# Altium schematic sheet 06_SAMA7G54-PMIC.SchDoc
size 420 x 297 mm; SheetNumber: 26; SheetTotal: 29
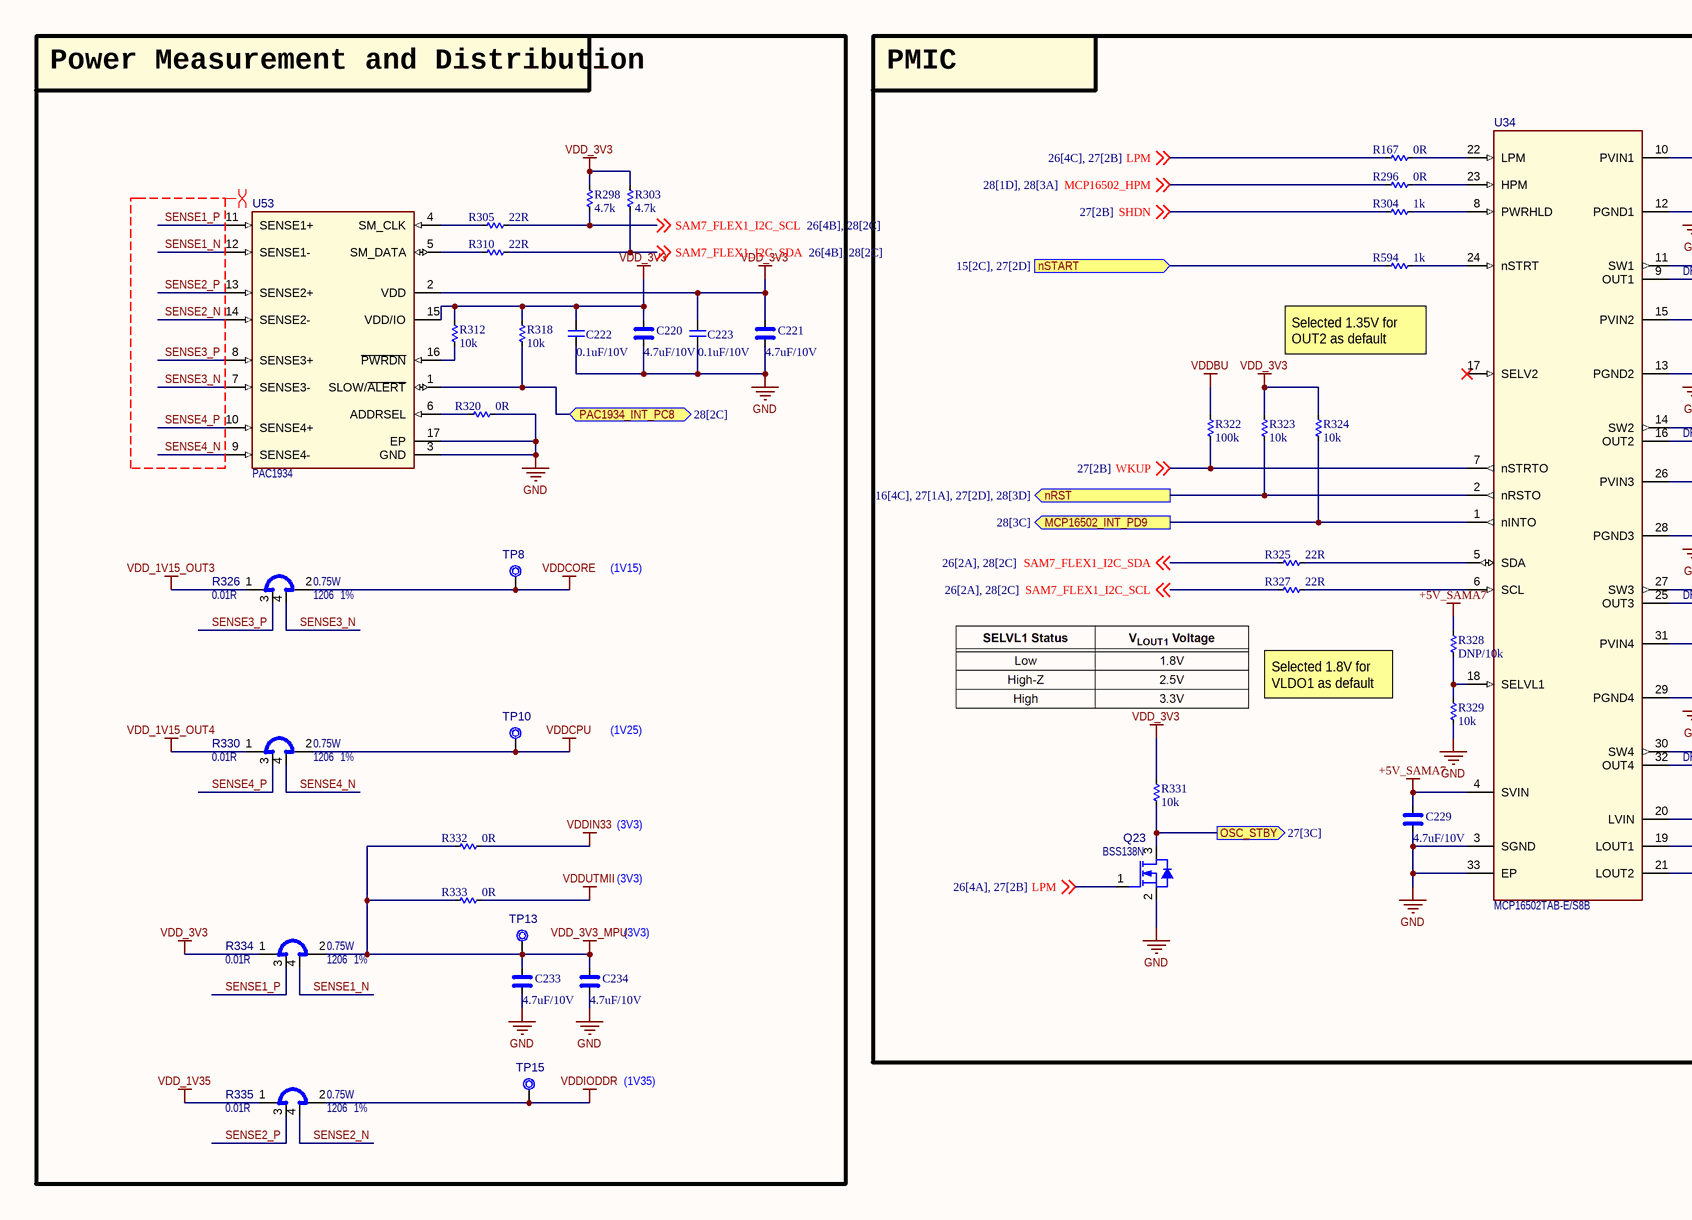
[diagram p0: 06_SAMA7G54-PMIC.SchDoc, left]
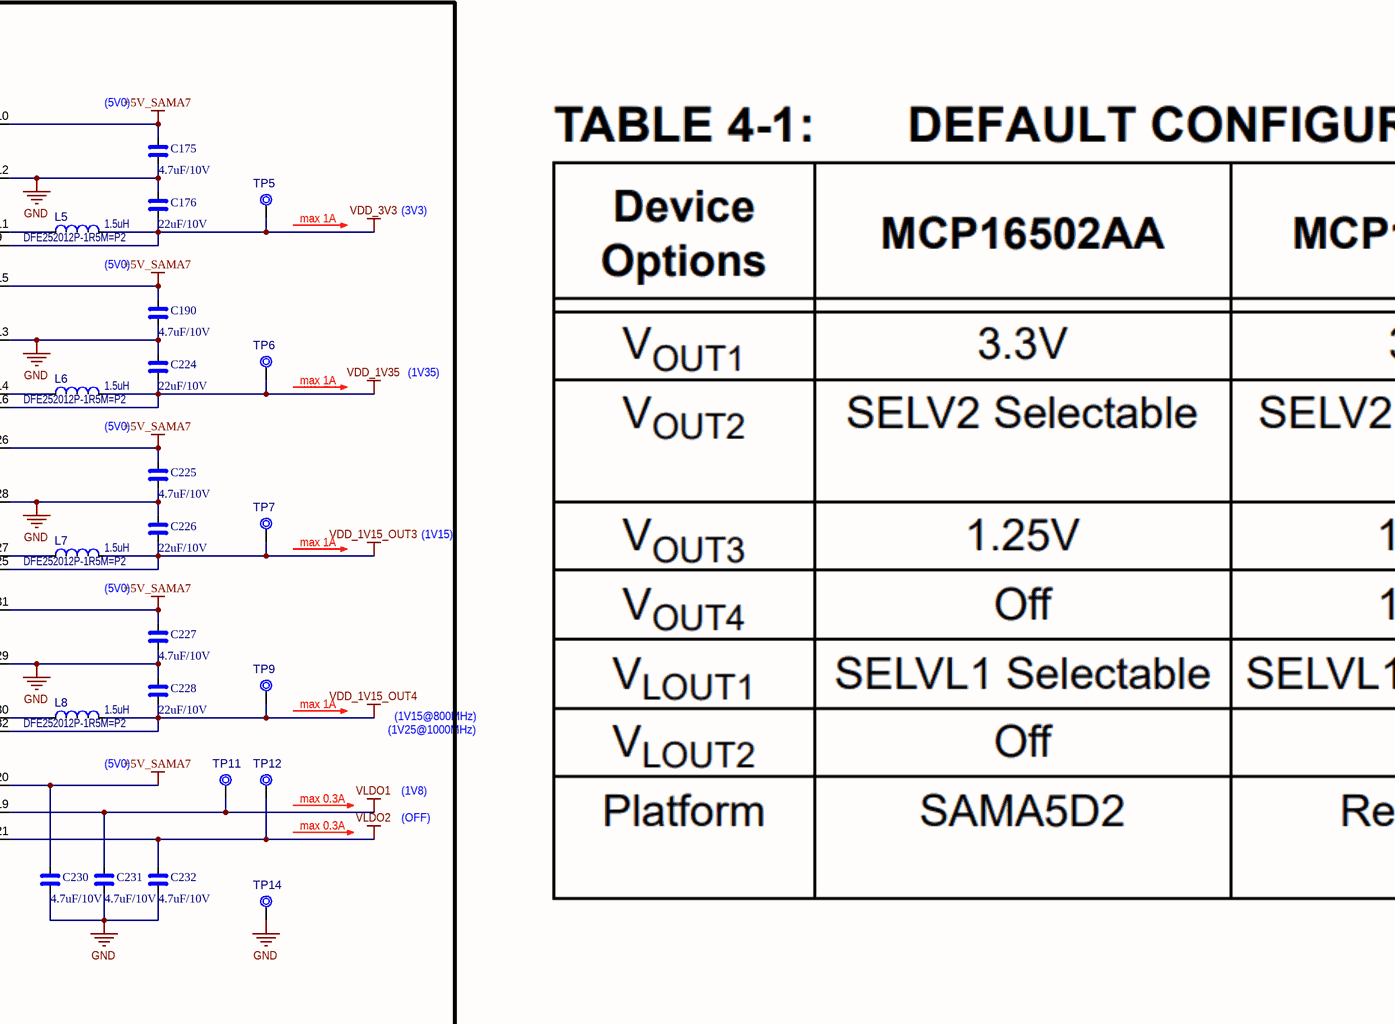
[diagram p1: 06_SAMA7G54-PMIC.SchDoc, middle]
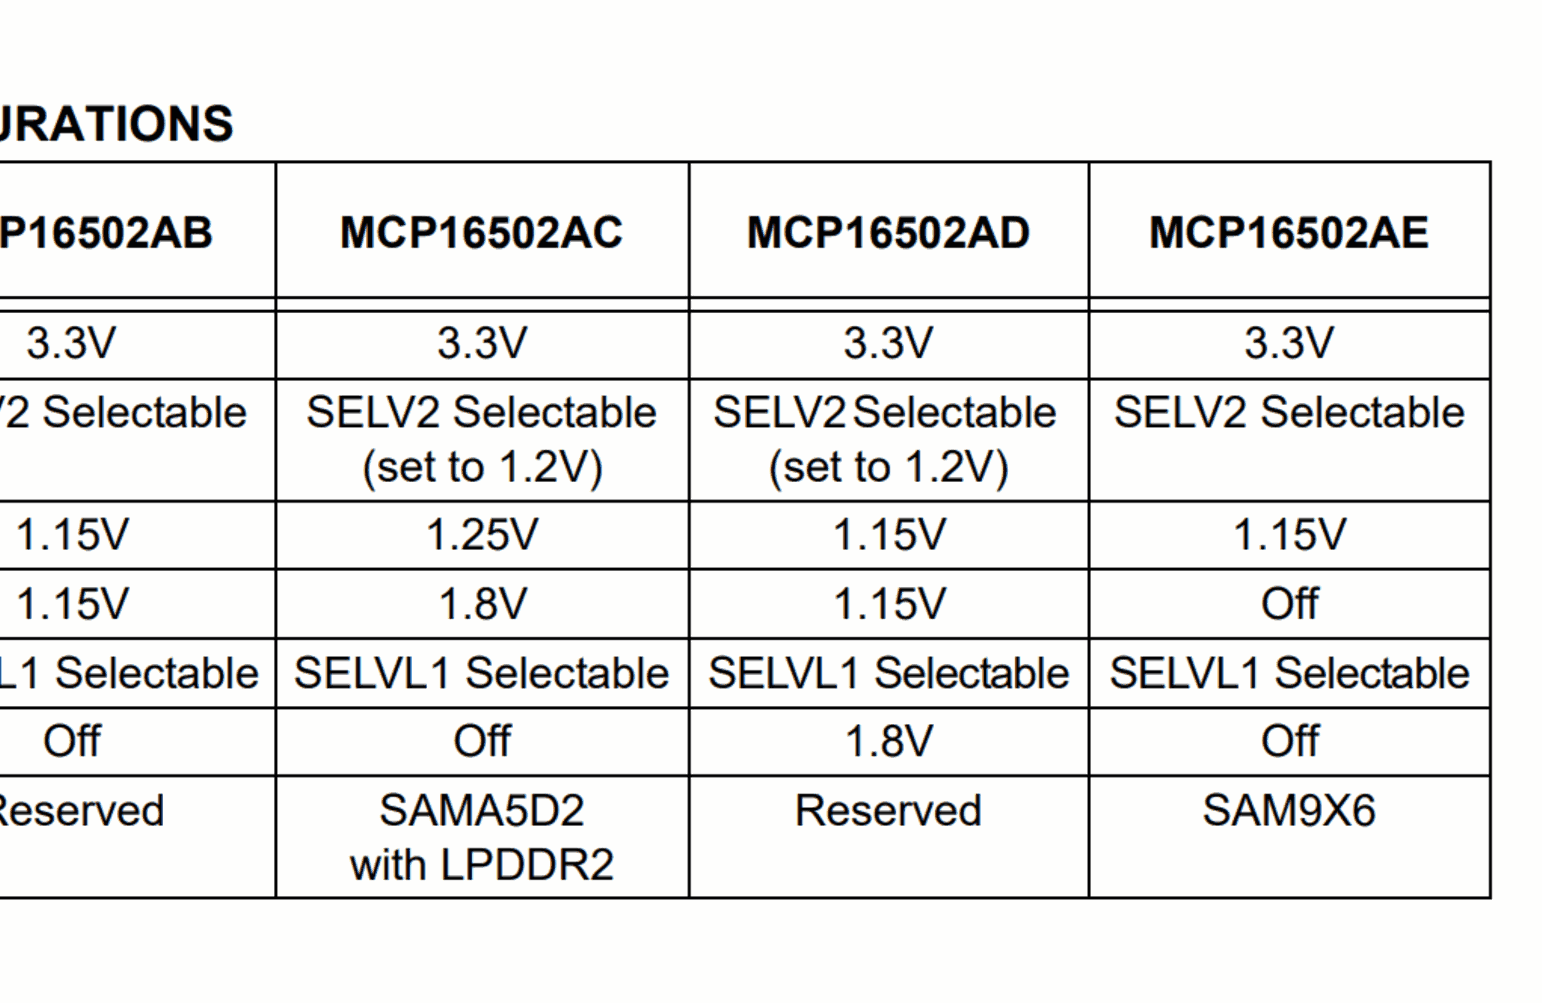
[diagram p2: 06_SAMA7G54-PMIC.SchDoc, right]

## Parts
C175  4.7uF/10V  [CAP_C_1005X50_L]
C176  22uF/10V  [CAP_C_1608X80]
C190  4.7uF/10V  [CAP_C_1005X50_L]
C220  4.7uF/10V  [CAP_C_1005X60]
C221  4.7uF/10V  [CAP_C_1005X60]
C222  0.1uF/10V  [CAP_C_1005X60]
C223  0.1uF/10V  [CAP_C_1005X60]
C224  22uF/10V  [CAP_C_1608X80]
C225  4.7uF/10V  [CAP_C_1005X50_L]
C226  22uF/10V  [CAP_C_1608X80]
C227  4.7uF/10V  [CAP_C_1005X50_L]
C228  22uF/10V  [CAP_C_1608X80]
C229  4.7uF/10V  [CAP_C_1005X50_L]
C230  4.7uF/10V  [CAP_C_1005X50_L]
C231  4.7uF/10V  [CAP_C_1005X50_L]
C232  4.7uF/10V  [CAP_C_1005X50_L]
C233  4.7uF/10V  [CAP_C_1005X60]
C234  4.7uF/10V  [CAP_C_1005X60]
L5  value 1.5uH  Manufacturer Part Number 1: DFE252012P-1R5M=P2  [IND_C_1008]  (hidden comment: Inductor)
L6  value 1.5uH  Manufacturer Part Number 1: DFE252012P-1R5M=P2  [IND_C_1008]  (hidden comment: Inductor)
L7  value 1.5uH  Manufacturer Part Number 1: DFE252012P-1R5M=P2  [IND_C_1008]  (hidden comment: Inductor)
L8  value 1.5uH  Manufacturer Part Number 1: DFE252012P-1R5M=P2  [IND_C_1008]  (hidden comment: Inductor)
Q23  value BSS138N  [SOT-23-3]  (hidden comment: Transistor MOS-N GSD)
R167  0R  [RES_C_1608X60]
R296  0R  [RES_C_1608X60]
R298  4.7k  [RES_C_1005X40]
R303  4.7k  [RES_C_1005X40]
R304  1k  [RES_C_1005X40]
R305  22R  [RES_C_1005X40]
R310  22R  [RES_C_1005X40]
R312  10k  [RES_C_1005X40]
R318  10k  [RES_C_1005X40]
R320  0R  [RES_C_1005X40]
R322  100k  [RES_C_1005X40]
R323  10k  [RES_C_1005X40]
R324  10k  [RES_C_1005X40]
R325  22R  [RES_C_0603X30]
R326  value 0.01R  Package: 1206  Tolerance: 1%  Power: 0.75W  [RES_C_1206_SHUNT]  (hidden comment: Shunt 4 Pin)
R327  22R  [RES_C_0603X30]
R328  DNP/10k  [RES_C_1005X40]
R329  10k  [RES_C_1005X40]
R330  value 0.01R  Package: 1206  Tolerance: 1%  Power: 0.75W  [RES_C_1206_SHUNT]  (hidden comment: Shunt 4 Pin)
R331  10k  [RES_C_1005X40]
R332  0R  [RES_C_1608X60]
R333  0R  [RES_C_1608X60]
R334  value 0.01R  Package: 1206  Tolerance: 1%  Power: 0.75W  [RES_C_1206_SHUNT]  (hidden comment: Shunt 4 Pin)
R335  value 0.01R  Package: 1206  Tolerance: 1%  Power: 0.75W  [RES_C_1206_SHUNT]  (hidden comment: Shunt 4 Pin)
R594  1k  [RES_C_1005X40]
TP5  Test Point No BOM  [Testpoint_80]  (value not drawn)  (no BOM)
TP6  Test Point No BOM  [Testpoint_80]  (value not drawn)  (no BOM)
TP7  Test Point No BOM  [Testpoint_80]  (value not drawn)  (no BOM)
TP8  Test Point No BOM  [Testpoint_80]  (value not drawn)  (no BOM)
TP9  Test Point No BOM  [Testpoint_80]  (value not drawn)  (no BOM)
TP10  Test Point No BOM  [Testpoint_80]  (value not drawn)  (no BOM)
TP11  Test Point No BOM  [Testpoint_80]  (value not drawn)  (no BOM)
TP12  Test Point No BOM  [Testpoint_80]  (value not drawn)  (no BOM)
TP13  Test Point No BOM  [Testpoint_80]  (value not drawn)  (no BOM)
TP14  Test Point No BOM  [Testpoint_80]  (value not drawn)  (no BOM)
TP15  Test Point No BOM  [Testpoint_80]  (value not drawn)  (no BOM)
U34  MCP16502TAB-E/S8B  [QFN-32_5X5_EP3.7X3.7]
U53  value PAC1934  [UQFN-16_4X4_EP2.6X2.6]  (hidden comment: PAC1934 UQFN-16)

## Blocks framed on the sheet
Power Measurement and Distribution: C220-C223 C233 C234 R298 R303 R305 R310 R312 R318 R320 R326 R330 R332-R335 TP8 TP10 TP13 TP15 U53
PMIC: C175 C176 C190 C224-C232 L5-L8 Q23 R167 R296 R304 R322-R325 R327-R329 R331 R594 TP5-TP7 TP9 TP11 TP12 TP14 U34

## Ports
MCP16502_INT_PD9 (out, see 28[3C]), nRST (out, see 16[4C], 27[1A], 27[2D], 28[3D]), nSTART (in, see 15[2C], 27[2D]), OSC_STBY (out, see 27[3C]), PAC1934_INT_PC8 (bidir, see 28[2C])

## Nets
+5V_SAMA7: C175.1 C190.1 C225.1 C227.1 C229.1 C230.1 R328.2 U34.4(SVIN) U34.10(PVIN1) U34.15(PVIN2) U34.20(LVIN) U34.26(PVIN3) U34.31(PVIN4)
GND: C175.2 C176.1 C190.2 C220.2 C221.2 C222.2 C223.2 C224.1 C225.2 C226.1 C227.2 C228.1 C229.2 C230.2 C231.2 C232.2 C233.2 C234.2 Q23.2(S) R320.2 R329.1 TP14.1 U34.3(SGND) U34.12(PGND1) U34.13(PGND2) U34.28(PGND3) U34.29(PGND4) U34.33(EP) U53.3(GND) U53.17(EP)
VDD_1V15_OUT3: C226.2 L7.2(F) R326.1 TP7.1 U34.25(OUT3)
VDD_1V15_OUT4: C228.2 L8.2(F) R330.1 TP9.1 U34.32(OUT4)
VDD_1V35: C224.2 L6.2(F) R335.1 TP6.1 U34.16(OUT2)
VDD_3V3: C176.2 C220.1 C221.1 C222.1 C223.1 L5.2(F) R298.1 R303.1 R312.1 R318.1 R323.2 R324.2 R331.2 R334.1 TP5.1 U34.9(OUT1) U53.2(VDD) U53.15(VDD/IO)
VDD_3V3_MPU: C233.1 C234.1 R332.2 R333.2 R334.2 TP13.1
VDDBU: R322.2
VDDCORE: R326.2 TP8.1
VDDCPU: R330.2 TP10.1
VDDIN33: R332.1
VDDIODDR: R335.2 TP15.1
VDDUTMII: R333.1
VLDO1: C231.1 TP11.1 U34.19(LOUT1)
VLDO2: C232.1 TP12.1 U34.21(LOUT2)
LPM: Q23.1(G) R167.2 ; off-sheet LPM
MCP16502_HPM: R296.2 ; off-sheet MCP16502_HPM
MCP16502_INT_PD9: R324.1 U34.1(nINTO) ; port MCP16502_INT_PD9
nRST: R323.1 U34.2(nRSTO) ; port nRST
nSTART: R594.1 ; port nSTART
OSC_STBY: Q23.3(D) R331.1 ; port OSC_STBY
PAC1934_INT_PC8: R318.2 U53.1(SLOW/~{ALERT}) ; port PAC1934_INT_PC8
SAM7_FLEX1_I2C_SCL: R298.2 R305.1 R327.2 ; off-sheet SAM7_FLEX1_I2C_SCL
SAM7_FLEX1_I2C_SDA: R303.2 R310.1 R325.2 ; off-sheet SAM7_FLEX1_I2C_SDA
SENSE1_N: R334.4 U53.12(SENSE1-)
SENSE1_P: R334.3 U53.11(SENSE1+)
SENSE2_N: R335.4 U53.14(SENSE2-)
SENSE2_P: R335.3 U53.13(SENSE2+)
SENSE3_N: R326.4 U53.7(SENSE3-)
SENSE3_P: R326.3 U53.8(SENSE3+)
SENSE4_N: R330.4 U53.9(SENSE4-)
SENSE4_P: R330.3 U53.10(SENSE4+)
SHDN: R304.1 ; off-sheet SHDN
WKUP: R322.1 U34.7(nSTRTO) ; off-sheet WKUP
NetL5_1: L5.1(S) U34.11(SW1)
NetL6_1: L6.1(S) U34.14(SW2)
NetL7_1: L7.1(S) U34.27(SW3)
NetL8_1: L8.1(S) U34.30(SW4)
NetR167_1: R167.1 U34.22(LPM)
NetR296_1: R296.1 U34.23(HPM)
NetR304_2: R304.2 U34.8(PWRHLD)
NetR305_2: R305.2 U53.4(SM_CLK)
NetR310_2: R310.2 U53.5(SM_DATA)
NetR312_2: R312.2 U53.16(~{PWRDN})
NetR320_1: R320.1 U53.6(ADDRSEL)
NetR325_1: R325.1 U34.5(SDA)
NetR327_1: R327.1 U34.6(SCL)
NetR328_1: R328.1 R329.2 U34.18(SELVL1)
NetR594_2: R594.2 U34.24(nSTRT)

Not connected (* = marked no-connect by the designer): U34 17(SELV2)*

## Layout directives
differential pair; differential pair class DIFF: SENSE1_N, SENSE1_P, SENSE2_N, SENSE2_P, SENSE3_N, SENSE3_P, SENSE4_N, SENSE4_P

## Notes on the sheet
- (near C175) (5V0)
- (5V0)
- (near TP5) max 1A
- (3V3)
- (near R594) Selected 1.35V for OUT2 as default
- (near TP6) max 1A
- (1V35)
- (1V15)
- (near TP7) max 1A
- Selected 1.8V for VLDO1 as default
- (1V25)
- (near TP9) max 1A
- (1V25@1000MHz)
- (1V15@800MHz)
- (near L8) (5V0)
- (near TP12) max 0.3A
- (1V8)
- (OFF)
- (near C234) (3V3)
- Project:
- Sub-system:
- Design by:
- Sheet title:
- Sheet
- of
- Checked by:
- Approved by:
- Revision:
- Document No:
- Size:
- Date:
- A3

## Library data of the parts
C175 C176 C190 C220 C221 C224-C234 = _CAP_C_High_2: CAP CHIP High Value
C222 C223 = _CAP_C_2: CAP CHIP
L5-L8 = IND1335: Manufacturer 1: Murata Electronics North America; Description_: INDUCTOR 1.5uH 3.5A 20% SMD 1008; Dev Tools Status: Design; Owner: Razvan Cristescu; DCR: 0.06R; RMS Current: 3.5A; Test Frequency: 1MHz; Populated: YES; MCHP-ID: IND1335; Revision: A; Symbol: Inductor; Status: MCL Design; ComponentLink1URL: https://chn-vm-apps.microchip.com/mchprepo/parts/Datasheets/m_dfe252012p.pdf; ComponentLink1Description: SVN Datasheet; ComponentLink2URL: C:\ALTIUM_WORK\00001_MCHP-CDB\Datasheets\m_dfe252012p.pdf; ComponentLink2Description: Local Datasheet; ComponentLink3URL: C:\ALTIUM_WORK\00001_MCHP-CDB\Library\LibraryRefs\Inductor.SchLib; ComponentLink3Description: Open Symbol; ComponentLink4URL: C:\ALTIUM_WORK\00001_MCHP-CDB\Library\Footprints\IND_C_1008.PcbLib; ComponentLink4Description: Open Footprint; ComponentLink5Description: Open Footprint 2; ComponentLink6Description: Open Footprint 3; ComponentLink7Description: Open Footprint 4; Package: 1008; Type: Inductor; Category: Inductor; Supplier 1: Digi-Key; Supplier Part Number 1: 490-10648-6-ND; Quantity Override: 1
Q23 = TRA1223: Transistor MOS; Manufacturer 1: Infineon Technologies; Manufacturer Part Number 1: BSS138NH6327XTSA2; Description_: TRANS FET N-CH BSS138N 60V 230mA SOT23-3; Dev Tools Status: Production; Type: FET; Current: 230mA; Drain to Source Voltage: 60V; Gate to Source Voltage: 20V; Power: 0.36W; Owner: Dragos Danaila; Populated: YES; MCHP-ID: TRA1223; Revision: 1; Symbol: Transistor MOS-N GSD; Status: MCL Design; Package: SOT23-3; ComponentLink1URL: https://chn-vm-apps.microchip.com/mchprepo/parts/Datasheets/Infineon-BSS138N-DS-v02_86-en.pdf; ComponentLink1Description: SVN Datasheet; ComponentLink2URL: C:\ALTIUM_WORK\00001_MCHP-CDB\Datasheets\Infineon-BSS138N-DS-v02_86-en.pdf; ComponentLink2Description: Local Datasheet; ComponentLink3URL: C:\ALTIUM_WORK\00001_MCHP-CDB\Library\LibraryRefs\Transistor MOS-N GSD.SchLib; ComponentLink3Description: Open Symbol; ComponentLink4URL: C:\ALTIUM_WORK\00001_MCHP-CDB\Library\Footprints\SOT-23-3.PcbLib; ComponentLink4Description: Open Footprint; ComponentLink5Description: Open Footprint 2; ComponentLink6Description: Open Footprint 3; ComponentLink7Description: Open Footprint 4; Operating Temperature: -55C to +150C; Category: Transistor; Voltage: 60V; Supplier 1: Digi-Key; Supplier Part Number 1: BSS138NH6327XTSA2CT-ND; Quantity Override: 1
R167 R296 R298 R303-R305 R310 R312 R318 R320 R322-R325 R327-R329 R331-R333 R594 = _RES_B_2: RES
R326 R330 R334 R335 = RSMT1316: Shunt; Manufacturer 1: SUSUMU; Manufacturer Part Number 1: KRL1632E-M-R010-F-T5; Description_: RES SHUNT MF 0.01R 1% 0.75W SMD 1206; Dev Tools Status: Design; Temperature Coeffcient: 50ppm/C; Current: 8A; Owner: Ciprian Abramov; Populated: YES; MCHP-ID: RSMT1316; Revision: 1; Symbol: Shunt 4 Pin; Status: MCL Design; ComponentLink1URL: https://chn-vm-apps.microchip.com/mchprepo/parts/Datasheets/n_catalog_partition09_en.pdf; ComponentLink1Description: SVN Datasheet; ComponentLink2URL: C:\ALTIUM_WORK\00001_MCHP-CDB\Datasheets\n_catalog_partition09_en.pdf; ComponentLink2Description: Local Datasheet; ComponentLink3URL: C:\ALTIUM_WORK\00001_MCHP-CDB\Library\LibraryRefs\Shunt 4 Pin.SchLib; ComponentLink3Description: Open Symbol; ComponentLink4URL: C:\ALTIUM_WORK\00001_MCHP-CDB\Library\Footprints\RES_C_1206_SHUNT.PcbLib; ComponentLink4Description: Open Footprint; ComponentLink5Description: Open Footprint 2; ComponentLink6Description: Open Footprint 3; ComponentLink7Description: Open Footprint 4; Operating Temperature: -55C to +155C; Category: Resistor; Type: RES SMD; Composition: MF; Supplier 1: Digi-Key; Supplier Part Number 1: 408-1570-1-ND; Quantity Override: 1
TP5-TP15 = CON1759: Test Point; Value: TP PAD PCB 1mm; Description_: CON TP PAD PCB 1mm SMD; Dev Tools Status: Design; Owner: Cristian Papuc; Populated: YES; MCHP-ID: CON1759; Revision: A; Symbol: Test Point No BOM; Status: MCL Design; ComponentLink1Description: SVN Datasheet; ComponentLink2Description: Local Datasheet; ComponentLink3URL: C:\ALTIUM_WORK\00001_MCHP-CDB\Library\LibraryRefs\Test Point No BOM.SchLib; ComponentLink3Description: Open Symbol; ComponentLink4URL: C:\ALTIUM_WORK\00001_MCHP-CDB\Library\Footprints\TP_1mm_SMD.PcbLib; ComponentLink4Description: Open Footprint; ComponentLink5Description: Open Footprint 2; ComponentLink6Description: Open Footprint 3; ComponentLink7Description: Open Footprint 4; Type: Test Point; Category: Connector; Quantity Override: 1
U34 = MIC8878: Manufacturer 1: Microchip Technology; Populated: YES; Description_: MCHP ANALOG PMIC SWITCHER Buck ADJ MCP16502TAB-E/S8B QFN-32 for SAMA7G5 MPU with LPDDR/DDR2/DDR3; Dev Tools Status: Design; Owner: Dragos Danaila; MCHP-ID: MIC8878; Value: MCP16502TAB-E/S8B; Symbol: MCP16502 QFN-32; Type: Switcher; Status: MCL Design; Revision: 1; Category: MCHP-Analog; ComponentLink1Description: SVN Datasheet; ComponentLink2Description: Local Datasheet; ComponentLink3URL: C:\ALTIUM_WORK\00001_MCHP-CDB\Library\LibraryRefs\MCP16502 QFN-32.SchLib; ComponentLink3Description: Open Symbol; ComponentLink4URL: C:\ALTIUM_WORK\00001_MCHP-CDB\Library\Footprints\QFN-32_5X5_EP3.7X3.7.PcbLib; ComponentLink4Description: Open Footprint; ComponentLink5Description: Open Footprint 2; ComponentLink6Description: Open Footprint 3; ComponentLink7Description: Open Footprint 4; Manufacturer Part Number 1: MCP16502TAB-E/S8B; Supplier 1: Digi-Key; Supplier Part Number 1: 150-MCP16502TAB-E/S8BCT-ND; Quantity Override: 1; ComponentLink2URL: C:\ALTIUM_WORK\00001_MCHP-CDB\Datasheets\MCP16502-High-Performance-PMIC-for-SAMA5DX-SAM9X6-MPUs-Data-Sheet-DS20006275B.pdf
U53 = MIC8883: Manufacturer 1: Microchip Technology; Manufacturer Part Number 1: PAC1934T-I/JQ; Description_: MCHP ANALOG POWER CURRENT SENSE MONITOR PAC1934T-I/JQ UQFN-16; Dev Tools Status: Design; Owner: Ciprian Abramov; Populated: YES; MCHP-ID: MIC8883; Symbol: PAC1934 UQFN-16; Type: Power/Current Sensor; Status: MCL Design; Revision: 1; Category: MCHP-Analog; ComponentLink1Description: SVN Datasheet; ComponentLink2Description: Local Datasheet; ComponentLink3URL: C:\ALTIUM_WORK\00001_MCHP-CDB\Library\LibraryRefs\PAC1934 UQFN-16.SchLib; ComponentLink3Description: Open Symbol; ComponentLink4URL: C:\ALTIUM_WORK\00001_MCHP-CDB\Library\Footprints\UQFN-16_4X4_EP2.6X2.6.PcbLib; ComponentLink4Description: Open Footprint; ComponentLink5Description: Open Footprint 2; ComponentLink6Description: Open Footprint 3; ComponentLink7Description: Open Footprint 4; Supplier 1: Digi-Key; Supplier Part Number 1: PAC1934T-I/JQCT-ND; Quantity Override: 1